# Altium schematic sheet power.SchDoc
size Letter
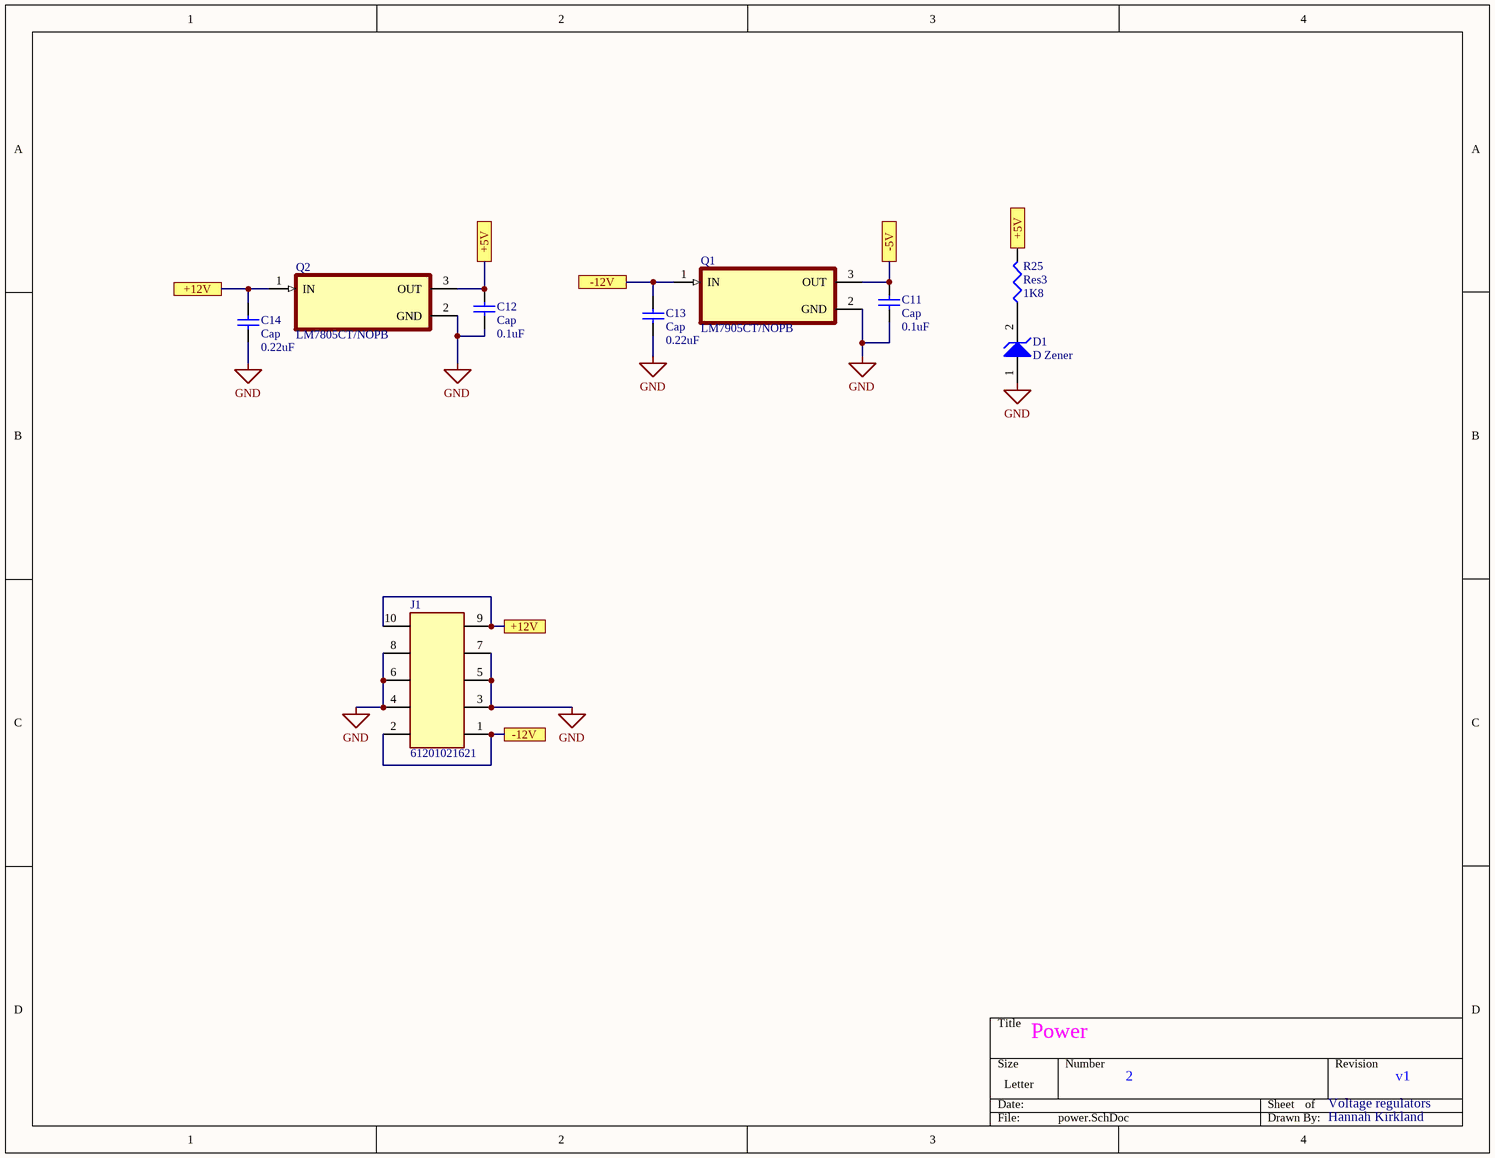
[diagram p0: power.SchDoc]

## Parts
C11  Cap  value 0.1uF  [C1206]
C12  Cap  value 0.1uF  [C1206]
C13  Cap  value 0.22uF  [C1206]
C14  Cap  value 0.22uF  [C1206]
D1  D Zener  [SOT23_N]
J1  61201021621  [61201021621]
Q1  LM7905CT/NOPB  [TO254P1524X483-4N]
Q2  LM7805CT/NOPB  [TO254P1524X483-4N]
R25  Res3  value 1K8  [C1206]

## Ports
+5V, +12V, -5V, -12V

## Nets
GND: C11.1 C12.1 C13.1 C14.1 D1.1(A) J1.3 J1.4 J1.5 J1.6 J1.7 J1.8 Q1.2(GND) Q2.2(GND)
+5V: C12.2 Q2.3(OUT) R25.2 ; port +5V
+12V: C14.2 J1.9 J1.10 Q2.1(IN) ; port +12V
-5V: C11.2 Q1.3(OUT) ; port -5V
-12V: C13.2 J1.1 J1.2 Q1.1(IN) ; port -12V
NetD1_2: D1.2(K) R25.1

## Notes on the sheet
- Power
- 2
- Voltage regulators
- v1
- Hannah Kirkland

## Library data of the parts
C11-C14 = Cap: Capacitor; Published: 8-Jun-2000; LatestRevisionDate: 17-Jul-2002; LatestRevisionNote: Re-released for DXP Platform.; PackageReference: RAD-0.3; Publisher: Altium Limited; PackageDescription: Radial Cap, Thru-Hole; 2 Leads; 0.3 in Pin Spacing
D1 = D Zener: Zener Diode; pin to pad: 1>2 2>3; Published: 8-Jun-2000; LatestRevisionDate: 17-Jul-2002; LatestRevisionNote: Re-released for DXP Platform.; PackageReference: DIODE-0.7; Publisher: Altium Limited; PackageDescription: Diode, Thru-Hole; 2 Leads; 0.7 in Pin Spacing
J1 = 61201021621: Connector Header Through Hole 10 position 0.100 _2.54mm_; MF: Wurth Electronics; Price: None; Package: None; Value: *; MP: 61201021621; Availability: Unavailable; SnapEDA_Link: https://www.snapeda.com/parts/61201021621/Wurth%20Electronics%20Inc./view-part/1156232/?ref=snap
Q1 Q2 = LM7805CT/NOPB: 1.5-A, 30-V, linear voltage regulator 3-TO-220 0 to 125; MF: Texas Instruments; Package: TO-220-3 Texas Instruments; Texas_Instruments-Purchase-URL: https://snapeda.com/shop?store=Texas+Instruments&id=6627; Value: *; Price: None; MP: LM7805CT/NOPB; Availability: Unavailable; SnapEDA_Link: https://www.snapeda.com/parts/LM7805CT/NOPB/Texas%20Instruments/view-part/6627/?ref=snap
R25 = Res3: Resistor; Published: 8-Jun-2000; LatestRevisionDate: 29-May-2009; LatestRevisionNote: IPC-7351 Footprint Added.; PackageReference: J1-0603; Publisher: Altium Limited; PackageDescription: Chip Resistor